# Altium schematic sheet Power Supply.SchDoc
size A4
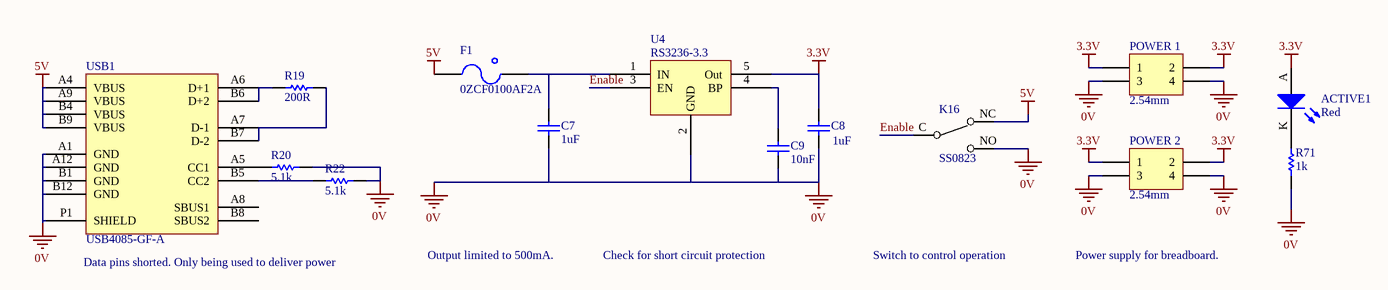
[diagram p0: Power Supply.SchDoc]

## Parts
ACTIVE1  Red  [0805 LED]
C7  1uF  [0805]
C8  1uF  [0805]
C9  10nF  [0805]
F1  0ZCF0100AF2A  [2920]
K16  SS0823  [Jaycar 2.54 SPDT Slide]
POWER_1  2.54mm  [Header 2x2]
POWER_2  2.54mm  [Header 2x2]
R19  200R  [0805]
R20  5.1k  [0805]
R22  5.1k  [0805]
R71  1k  [0805]
U4  RS3236-3.3  [Runic SOT-23-5]
USB1  USB4085-GF-A  [USB4085-GF-A]

## Nets
0V: C7.1 C8.1 C9.1 K16.NO POWER_1.3 POWER_1.4 POWER_2.3 POWER_2.4 R20.2 R22.2 R71.1 U4.2(GND) USB1.A1(GND) USB1.A12(GND) USB1.B1(GND) USB1.B12(GND) USB1.P1(SHIELD)
3.3V: ACTIVE1.A C8.2 POWER_1.1 POWER_1.2 POWER_2.1 POWER_2.2 U4.5(Out)
5V: F1.1 K16.NC USB1.A4(VBUS) USB1.A9(VBUS) USB1.B4(VBUS) USB1.B9(VBUS)
Enable: K16.C U4.3(EN)
NetACTIVE1_K: ACTIVE1.K R71.2
NetC7_2: C7.2 F1.2 U4.1(IN)
NetC9_2: C9.2 U4.4(BP)
NetR19_1: R19.1 USB1.A6(D+1) USB1.B6(D+2)
NetR19_2: R19.2 USB1.A7(D-1) USB1.B7(D-2)
NetR20_1: R20.1 USB1.A5(CC1)
NetR22_1: R22.1 USB1.B5(CC2)

Not connected (* = marked no-connect by the designer): USB1 A8(SBUS1) B8(SBUS2)

## Notes on the sheet
- (near USB1) Data pins shorted. Only being used to deliver power
- Output limited to 500mA.
- Check for short circuit protection
- Switch to control operation
- Power supply for breadboard.
- Title
- Size:
- Date:
- A4
- Number:
- Time:
- Revision:
- Sheet
- of
- File:

## Library data of the parts
ACTIVE1 = SML-210LTT86: Red LED Indication - Discrete 1.75V 0805 (2012 Metric); Manufacturer: ROHM Semiconductor; Part Number: SML-210LTT86; Colour: Red; Digikey Part Number: 511-1286-1-ND; Digikey Link: https://www.digikey.com/product-detail/en/rohm-semiconductor/SML-210LTT86/511-1286-1-ND/637099
C7 C8 = GCM21BR71A105KA37L: Manufacturer: muRata; Tolerance: 10%; Material: X7R; Rated Voltage: 10V; Part Number: GCM21BR71A105KA37L; Value: 1uF
C9 = GCM21BR71H103KA37L: Manufacturer: muRata; Tolerance: 10%; Material: X7R; Rated Voltage: 50V; Part Number: GCM21BR71H103KA37L; Value: 10nF
F1 = 0ZCF0100AF2A: PTC RESET FUSE 60V 1A 292; Manufacturer: Littelfuse Inc.; Part Number: 0ZCF0100AF2A; Digikey Part Number: 507-2070-1-ND; Digikey Link: https://www.digikey.com/product-detail/en/bel-fuse-inc/0ZCF0100AF2A/507-2070-1-ND/6210547
K16 = SS0823: SPDT Switch; Manufacturer: Jaycar; Part Number: SS0823; Digikey Link: https://www.jaycar.com.au/sub-miniature-dpdt-pcb-mount-switch/p/SS0823
POWER_1 POWER_2 = Header 2x2: Positions: 4; Angle: 0; Flange: No; Contact: NA; Part Number: Header 2x2; Pitch: 2.54mm; Row Spacing: 2.54mm
R19 = RC0805FR07200RL: Manufacturer: YAGEO; Tolerance: 0.01; Rated Voltage: 0.125W; Part Number: RC0805FR07200RL; Value: 200R; Material: FR-07; qty: 50
R20 R22 = RC0805FR075K1L: Manufacturer: YAGEO; Tolerance: 0.01; Rated Voltage: 0.125W; Part Number: RC0805FR075K1L; Value: 5.1k; Material: FR-07; qty: 50
R71 = RC0805FR071KL: Manufacturer: YAGEO; Tolerance: 0.01; Rated Voltage: 0.125W; Part Number: RC0805FR071KL; Value: 1k; Material: FR-07; qty: 50
U4 = RS3236-3.3: Low Power, Low Dropout, 500mA RF LinearRegulators; Manufacturer: RUNIC; Part Number: RS3236-3.3; Digikey Link: http://www.run-ic.com/Public/attached/file/201811/1542246949_88491.pdf
USB1 = USB4085-GF-A: USB - C (Type - C) USB 2.0 Receptacle Connector 16 Position Through Hole, Right Angle; Angle: 90; Part Number: USB4085-GF-A; Digikey Part Number: 2073-USB4085-GF-ACT-ND; Digikey Link: https://www.digikey.ee/product-detail/en/gct/USB4085-GF-A/2073-USB4085-GF-ACT-ND/9859733